# EAGLE design 2layer_50 (EAGLE 9.2.2)
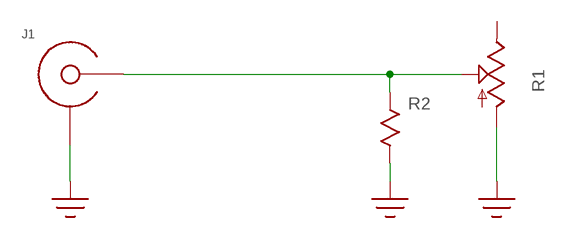
[diagram p0: schematic, sheet 1]

## Parts
J1  EDGE_LAUNCH_JACKNARROW  [EDGE_LAUNCH_RF_CON_NARROW]
R1  TRIM_US-SP19L  [SP19L]
R2  R0603  [R0603]

## Nets
GND: J1.GND@1(SHIELD) J1.GND@2(SHIELD) J1.GND@3(SHIELD) J1.GND@4(SHIELD) J1.GND@5(SHIELD) J1.GND@6(SHIELD) J1.SHIELD@1(SHIELD) J1.SHIELD@2(SHIELD) R1.A R2.P$2
N$1: J1.CENTER R1.S R2.P$1
Unconnected: R1.E

## Library data of the parts
J1 = yapo:EDGE_LAUNCH_JACK
R1 = pot:TRIM_US-: POTENTIOMETER
R2 = yapo:R

## Board
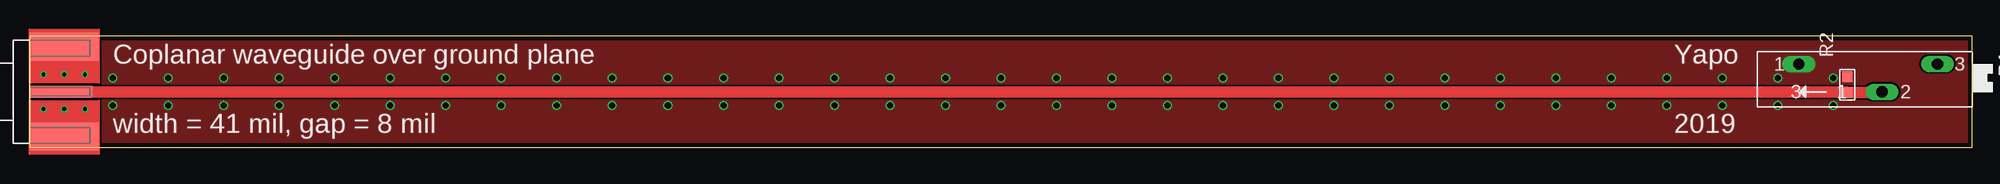
[diagram p1: board, top side]
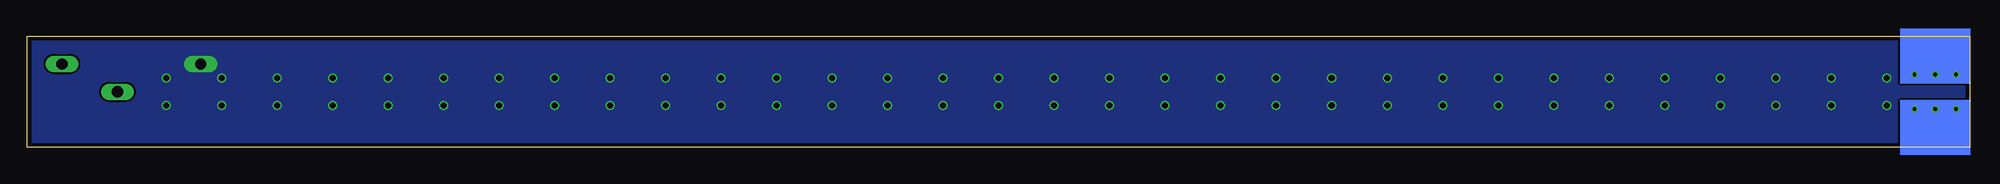
[diagram p2: board, bottom side, seen from below]

Size 177.8 x 10.16 mm. Coordinates in mm from the lower left corner, seen from the top.
Outline: 0,0 177.8,0 177.8,10.16 0,10.16 0,0
Copper layers (1*16): Top 0.035559375mm / dielectric 1.6mm / Bottom 0.035559375mm
Design rules "oshpark-2layer *": minimum track width 6mil, minimum drill 10mil, track to track 6mil, track to pad 6mil, pad to pad 6mil, via to via 6mil, smd to smd 6mil, copper to edge 15mil, drill to drill 6mil, minimum pad ring 5mil, minimum via ring 5mil, stop-mask expansion 2.5mil, vias tented up to drill 30mil, thermal gap 10mil

### Footprints (pad centres in the part's own frame; a part is rotated, then mirrored left to right if it is on the bottom)
EDGE_LAUNCH_RF_CON_NARROW = smd 5.715 x 1.041: CENTER -2.875,0 | drill 0.35: GND@1 -5.08,1.587; GND@2 -3.175,1.587; GND@3 -1.27,1.587; GND@4 -5.08,-1.587; GND@5 -3.175,-1.587; GND@6 -1.27,-1.587 | smd 6.35 x 2.54: SHIELD@1 -3.175,-4.128; SHIELD@2 -3.175,4.128
SP19L = drill 1.016 long: A 5.715,-1.27; E -6.985,-1.27; S -1.905,1.27
R0603 = smd 0.95 x 0.95: P$1 -0.725,0; P$2 0.725,0

### Placement (x,y rotation side)
J1  0,5.08 180 top
R1  167.64,6.35 180 top
R2  166.37,5.71 90 top

### Tracks (layer width: path | path; a pad name or v marks a point on that pad's centre or on a via)
GND  (via drill 0.55)
  other vias: 7.62,6.35 7.62,3.81 12.7,6.35 17.78,6.35 22.86,6.35 27.94,6.35 12.7,3.81 17.78,3.81 22.86,3.81 27.94,3.81 33.02,6.35 38.1,6.35 43.18,6.35 33.02,3.81 38.1,3.81 43.18,3.81 48.26,6.35 48.26,3.81 53.34,6.35 53.34,3.81 58.42,6.35 58.42,3.81 63.5,6.35 63.5,3.81 68.58,6.35 68.58,3.81 73.66,6.35 73.66,3.81 78.74,6.35 78.74,3.81 83.82,6.35 83.82,3.81 88.9,6.35 88.9,3.81 93.98,6.35 99.06,6.35 104.14,6.35 93.98,3.81 99.06,3.81 104.14,3.81 109.22,6.35 109.22,3.81 114.3,6.35 114.3,3.81 119.38,6.35 119.38,3.81 124.46,6.35 124.46,3.81 129.54,6.35 134.62,6.35 139.7,6.35 144.78,6.35 149.86,6.35 154.94,6.35 129.54,3.81 134.62,3.81 139.7,3.81 144.78,3.81 149.86,3.81 154.94,3.81 160.02,3.81 160.02,6.35 165.1,3.81 165.1,6.35
  pour Top (no thermals): 0,0 177.8,0 177.8,10.16 0,10.16
  pour Bottom (no thermals): 0,0 177.8,0 177.8,10.16 0,10.16
N$1
  Top 1.041: J1.CENTER 166.28,5.08 R2.P$1 169.46,4.99 R1.S

### Text on the board
tPlace: Coplanar waveguide over ground plane | Yapo | width = 41 mil, gap = 8 mil | 2019